# Altium schematic sheet VSD_I2C.SchDoc
size A4; SheetNumber: 1; SheetTotal: 1
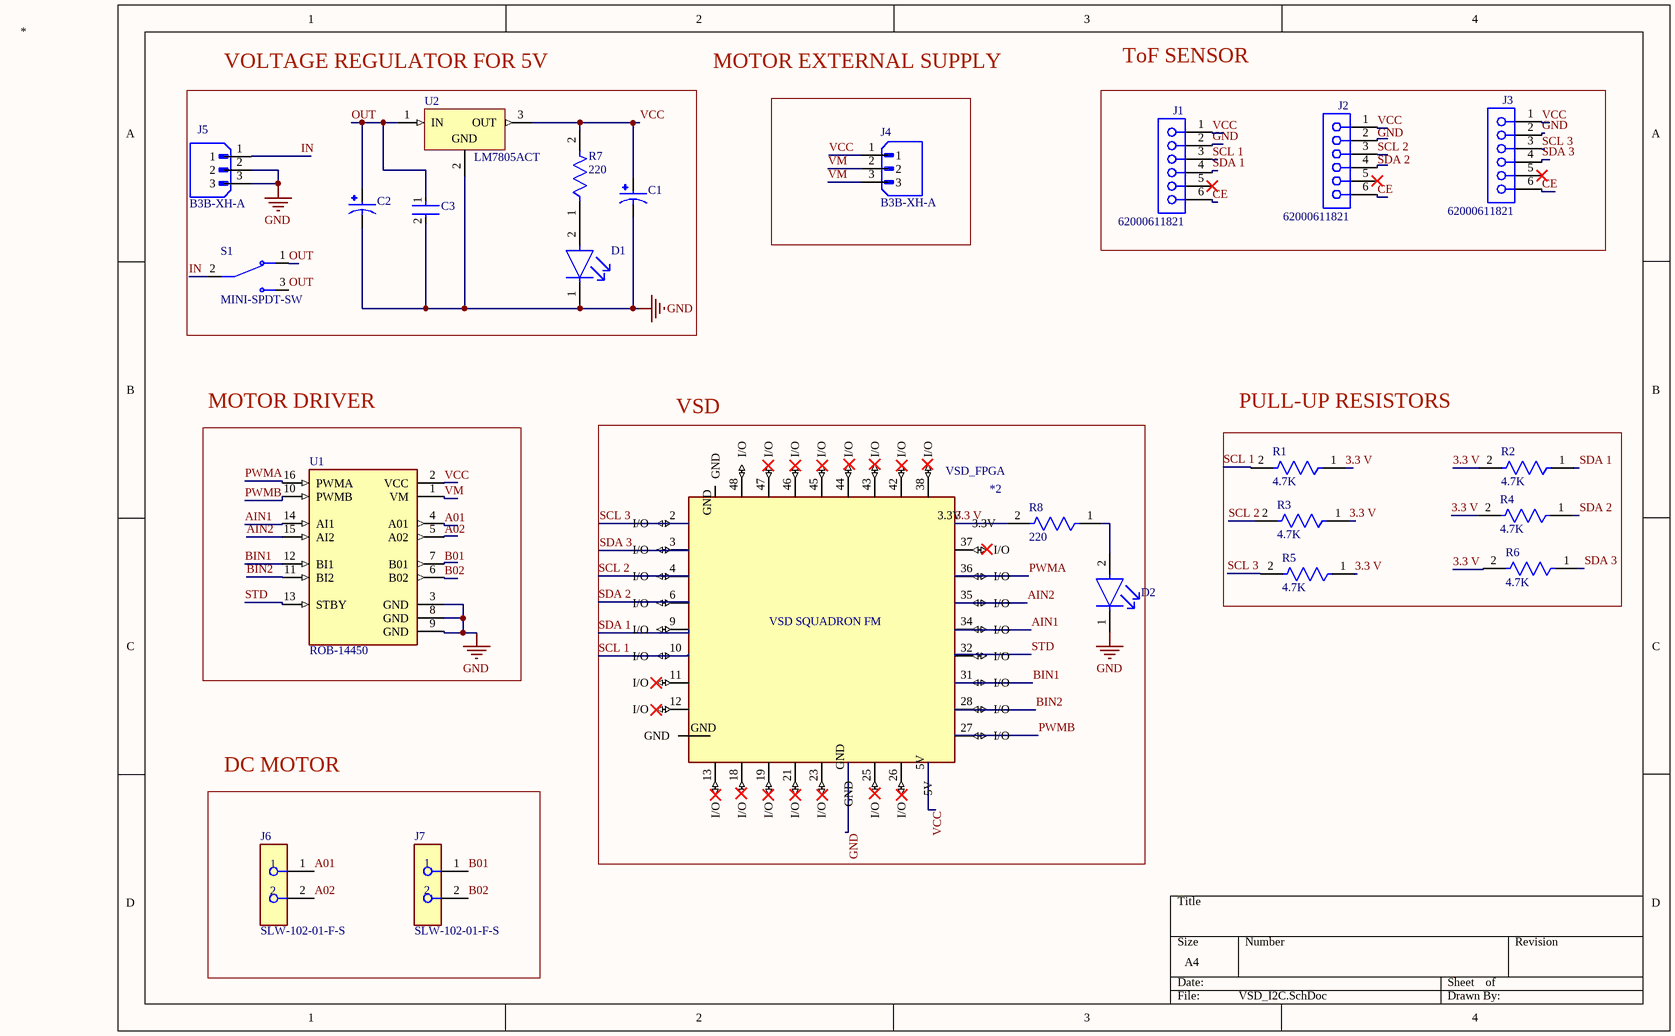
[diagram p0: VSD_I2C.SchDoc]

## Parts
*2  VSD_FPGA  [VSD_FPGA2]
C1  EEUEB1H2R2S  [CAPPRD200W50D500H1100]  (value not drawn)
C2  EEUEB1H2R2S  [CAPPRD200W50D500H1100]  (value not drawn)
C3  RCER72A104K1K1H03B  [FP-RCE1K1-2_5-MFG]  (value not drawn)
D1  VSLB3940  [FP-VSLB3940-MFG]  (value not drawn)
D2  VSLB3940  [FP-VSLB3940-MFG]  (value not drawn)
J1  62000611821  [62000611821]
J2  62000611821  [62000611821]
J3  62000611821  [62000611821]
J4  B3B-XH-A  [JST_B3B-XH-A]
J5  B3B-XH-A  [JST_B3B-XH-A]
J6  SLW-102-01-F-S  [FP-SLW-102-01-F-S-MFG]
J7  SLW-102-01-F-S  [FP-SLW-102-01-F-S-MFG]
R1  4.7K  [FP-MRS25-MFG]
R2  4.7K  [FP-MRS25-MFG]
R3  4.7K  [FP-MRS25-MFG]
R4  4.7K  [FP-MRS25-MFG]
R5  4.7K  [FP-MRS25-MFG]
R6  4.7K  [FP-MRS25-MFG]
R7  220  [FP-MRS25-MFG]
R8  220  [FP-MRS25-MFG]
S1  MINI-SPDT-SW  [SW_MINI-SPDT-SW]
U1  ROB-14450  [MODULE_ROB-14450]
U2  LM7805ACT  [FAIR-TO-220-3]

## Blocks framed on the sheet
VOLTAGE REGULATOR FOR 5V: C1-C3 D1 J5 R7 S1 U2
MOTOR DRIVER: U1
VSD: *2 D2 R8
PULL-UP RESISTORS: R1-R6
DC MOTOR: J6 J7

## Nets
GND: *2.GND C1.N C2.N C3.2 D1.1(C) D2.1(C) J1.2 J2.2 J3.2 J5.2 J5.3 U1.3(GND) U1.8(GND) U1.9(GND) U2.2(GND)
3.3 V: *2.3.3V R1.1 R2.2 R3.1 R4.2 R5.1 R6.2 R8.2
A01: J6.1 U1.4(A01)
A02: J6.2 U1.5(A02)
AIN1: *2.34(I/O) U1.14(AI1)
AIN2: *2.35(I/O) U1.15(AI2)
B01: J7.1 U1.7(B01)
B02: J7.2 U1.6(B02)
BIN1: *2.31(I/O) U1.12(BI1)
BIN2: *2.28(I/O) U1.11(BI2)
CE: J1.6 J2.6 J3.6
IN: J5.1 S1.2
OUT: C2.P C3.1 S1.1 S1.3 U2.1(IN)
PWMA: *2.36(I/O) U1.16(PWMA)
PWMB: *2.27(I/O) U1.10(PWMB)
SCL 1: *2.10(I/O) J1.3 R1.2
SCL 2: *2.4(I/O) J2.3 R3.2
SCL 3: *2.2(I/O) J3.3 R5.2
SDA 1: *2.9(I/O) J1.4 R2.1
SDA 2: *2.6(I/O) J2.4 R4.1
SDA 3: *2.3(I/O) J3.4 R6.1
STD: *2.32(I/O) U1.13(STBY)
VCC: *2.5V C1.P J1.1 J2.1 J3.1 J4.1 R7.2 U1.2(VCC) U2.3(OUT)
VM: J4.2 J4.3 U1.1(VM)
NetD1_2: D1.2(A) R7.1
NetD2_2: D2.2(A) R8.1

Not connected (* = marked no-connect by the designer): *2 11(I/O) 12(I/O) 13(I/O) 18(I/O) 19(I/O) 21(I/O) 23(I/O) 25(I/O) 26(I/O) 37(I/O) 38(I/O) 42(I/O) 43(I/O) 44(I/O) 45(I/O) 46(I/O) 47(I/O) 48(I/O); J1 5*; J2 5*; J3 5*

## Notes on the sheet
- *
- MOTOR EXTERNAL SUPPLY
- ToF SENSOR
- (in symbol VSD_FPGA) VSD SQUADRON FM

## Library data of the parts
*2 = VSD_FPGA: VSD SQUADROM FM FPGA
C1 C2 = EEUEB1H2R2S: CAPACITOR, 2.2UF, 50V, 5X11MM; Capacitance:2.2F; Capacitance Tolerance: 20%; Voltage Rating:50V; Life Time @ Temperature:5000 hours @ 105C; Height:11mm; Diameter:5mm; Capacitor Terminals:Radial Leaded; Lead Spacing:2mm; Operating Temperature Range:-40C to +105C; AC Ripple Current:15mA; Capacitor Mounting:Through Hole; MF: Panasonic; Package: RADIAL-2 Panasonic; Availability: No availability data; MP: EEUEB1H2R2S; SnapEDA_Link: https://www.snapeda.com/parts/EEUEB1H2R2S/Panasonic/view-part/5793710/?ref=snap; Value: *; Check_prices: https://www.snapeda.com/parts/EEUEB1H2R2S/Panasonic/view-part/5793710/?ref=eda; Price: None
C3 = CMP-06035-011084-1: Cap Ceramic Monolithic 100nF 100V 10% Thru-Hole Bulk; Dielectric: X7R; Lead/Base Style: Formed Leads; Lead Diameter: 0.5mm; Resistor Type: Ceramic; Voltage Rating: 100V; Case/Package: Radial; Packaging: Bulk; Capacitance: 100nF; Lead Pitch: 0.197inch; Height - Seated (Max): 0.138inch; Voltage Rating (DC): 100V; Mount: Through Hole; Height: 3.5mm; Width: 0.098inch; Termination: Radial; Tolerance: 10%; Min Operating Temperature: -55°C; Package Quantity: 500; Max Operating Temperature: 125°C; Length: 0.157inch; Ratings: AEC-Q200
D1 D2 = CMP-00030-18785862-1: VSLB3940 940 nm 100 mA ±22° Through Hole High Speed Infrared Emitting Diode - T-1; Power Rating: 160mW; Rise Time: 15ns; Peak Wavelength: 940nm; Lens Style: Circular, Diffused, Round; Reverse Voltage: 5V; Viewing Angle: 44°; Forward Current: 100mA; Number of Elements: 1; Forward Voltage: 1.35V; Length: 3.2mm; Min Operating Temperature: -25°C; Radiation Hardening: No; Power Dissipation: 160mW; Lead Free: Lead Free; Orientation: Top View; Case/Package: T; Max Power Dissipation: 160mW; Max Operating Temperature: 85°C; Fall Time: 15ns; Number of Pins: 2; Test Current: 100mA; NexarPartId: 18785862; RoHS: Compliant; REACH SVHC: Unknown; Mount: Through Hole; Number of LEDs: 1; Wavelength: 940nm; Packaging: Bulk; Depth: 3.2mm
J1-J3 = CMP-03913-65162165-3: THT Vertical Socket Header WR-PHD, Pitch 2.00 mm, Single Row, 6 pins; Operating Supply Voltage: 250V; Gender: Female; Current Rating: 2A; Contact Resistance: 20mΩ; Number of Pins: 6; Orientation: Vertical; Lead Pitch: 2mm
J4 J5 = B3B-XH-A: Connector Header Through Hole 3 position 0.098 (2.50mm); MF: JST Sales; SnapEDA_Link: https://www.snapeda.com/parts/B3B-XH-A/JST+Sales+America+Inc./view-part/?ref=snap; Package: None; Value: *; MP: B3B-XH-A; Check_prices: https://www.snapeda.com/parts/B3B-XH-A/JST+Sales+America+Inc./view-part/?ref=eda
J6 J7 = CMP-1023-00122-2: CONN RCPT 2POS 0.1 GOLD PCB; Number of Contacts: 2; Gender: Female; Pitch: 2.54mm; Voltage Rating (AC): 550V; RoHS Compliant: Yes; Contact Material: Bronze; Lead Free: Lead Free; Min Operating Temperature: -55°C; Max Operating Temperature: 125°C; Number of Rows: 1; Mount: Through Hole; Orientation: Vertical; Termination: Solder; Radiation Hardening: No; Contact Plating: Gold; Packaging: Bulk
R1-R6 R8 = CMP-00030-42757237-1: MRS25000C1000FRP00 Resistor, 100 Ohm, ± 1%, 600 mW, Axial Leaded, Metal Film (Thin Film), Professional; Max Power Dissipation: 600mW; Resistance: 100Ω; Voltage Rating: 350V; Temperature Coefficient: 50ppm/°C; Lead Diameter: 600µm; RoHS: Compliant; Radiation Hardening: No; Schedule B: 8533210090, 8533210090; Length: 6.5mm; Packaging: Tape & Reel (TR); Number of Terminations: 2; Mount: Through Hole; Width: 2.5mm; Tolerance: 1%; Military Standard: Not; Voltage Rating (DC): 350V; Contact Plating: Tin; Number of Pins: 2; Max Operating Temperature: 155°C; NexarPartId: 42757237; Diameter: 2.5mm; Composition: Metal Film, Thin Film; REACH SVHC: Unknown; Power Rating: 600mW; Lead Free: Lead Free; Termination: Axial; Case/Package: Axial; Min Operating Temperature: -55°C
R7 = CMP-00030-42757237-1: MRS25000C1000FRP00 Resistor, 220 Ohm, ± 1%, 600 mW, Axial Leaded, Metal Film (Thin Film), Professional; Max Power Dissipation: 600mW; Resistance: 220Ω; Voltage Rating: 350V; Temperature Coefficient: 50ppm/°C; Lead Diameter: 600µm; RoHS: Compliant; Radiation Hardening: No; Schedule B: 8533210090, 8533210090; Length: 6.5mm; Packaging: Tape & Reel (TR); Number of Terminations: 2; Mount: Through Hole; Width: 2.5mm; Tolerance: 1%; Military Standard: Not; Voltage Rating (DC): 350V; Contact Plating: Tin; Number of Pins: 2; Max Operating Temperature: 155°C; NexarPartId: 42757237; Diameter: 2.5mm; Composition: Metal Film, Thin Film; REACH SVHC: Unknown; Power Rating: 600mW; Lead Free: Lead Free; Termination: Axial; Case/Package: Axial; Min Operating Temperature: -55°C
S1 = MINI-SPDT-SW: Simple breadboard friendly SPDT slide switch. Rated at 30V/200mA with operating force of 250 +/-100gf.; Availability: Unavailable; Package: None; MP: MINI-SPDT-SW; Value: *; Price: None
U1 = ROB-14450: TB6612FNG Motor Controller/Driver Power Management Evaluation Board; MF: SparkFun Electronics; Check_prices: https://www.snapeda.com/parts/ROB-14450/SparkFun%20Electronics/view-part/2656367/?ref=eda; Package: None; MP: ROB-14450; Value: *; Availability: In Stock; SnapEDA_Link: https://www.snapeda.com/parts/ROB-14450/SparkFun%20Electronics/view-part/2656367/?ref=snap; Price: None
U2 = CMP-2000-04937-1: Positive Voltage Regulator, 5 V, 1 A, 0 to 125 degC, 3-Pin TO-220, RoHS, Tube; Manufacturer: Fairchild; Number of Outputs: 1; Typical Dropout Voltage @ Current: 2V@1A; Output Type: Fixed; Output Voltage: 5V; Quiescent Current: 6mA; Dropout Voltage Measurement Current: 1A; Line Regulation: 50mV; Maximum Input Voltage: 35V; Regulator Function: Linear; Load Regulation: 100mV; Package Type: TO-220; Mounting Type: ThroughHole; Height: 16.51mm; Maximum Operating Temperature: +125degC; Datasheet Version: Rev. 1.0.1, 05/2006; Package Reference: TO-220; Minimum Operating Temperature: 0degC; Manufacturer URL: https://www.fairchildsemi.com/; Package URL: https://www.fairchildsemi.com/package-drawings/TO/TO220B03.pdf; Length: 10.67mm; Series: LM78xx; Dimensions: 10.67x4.83x16.51mm; Polarity: Positive; Maximum Output Current: 1A; Pin Count: 3; Width: 4.83mm; Package Description: 3-Pin Through Hole Device, Body 10 x 4.5 mm, Pitch 2.54 mm; Datasheet URL: https://datasheet.ciiva.com/5816/1359194-5816420.pdf